# Altium schematic sheet Cross.SchDoc
size A4
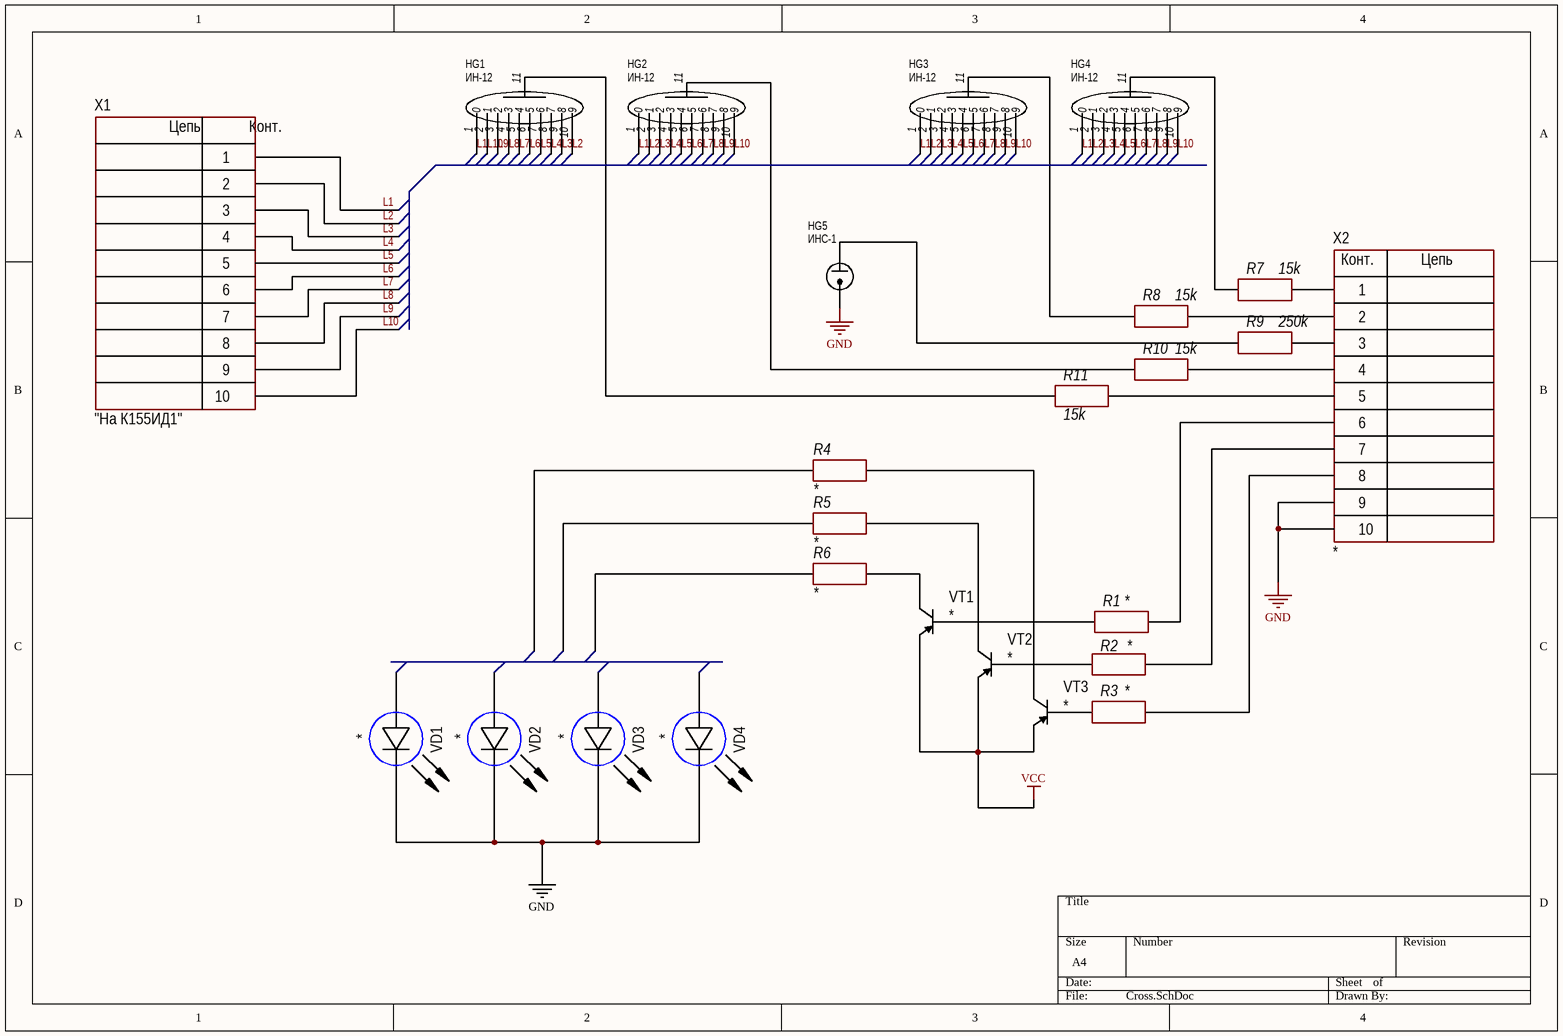
[diagram p0: Cross.SchDoc]

## Parts
HG1  ИН-12  [PCBComponent_1]
HG2  ИН-12  [PCBComponent_1]
HG3  ИН-12  [PCBComponent_1]
HG4  ИН-12  [PCBComponent_1]
HG5  ИНС-1  [ИНС-1]
R1  *  [MLT]
R2  *  [MLT]
R3  *  [MLT]
R4  *  [MLT]
R5  *  [MLT]
R6  *  [MLT]
R7  15k  [MLT]
R8  15k  [MLT]
R9  250k  [MLT]
R10  15k  [MLT]
R11  15k  [MLT]
VD1  *  [CH1206LY]
VD2  *  [CH1206LY]
VD3  *  [CH1206LY]
VD4  *  [CH1206LY]
VT1  *  [TO220_123]
VT2  *  [TO220_123]
VT3  *  [TO220_123]
X1  "На К155ИД1"  [CON: PLS-10]
X2  *  [CON: PLS-10]

## Nets
GND: HG5.1 VD1.2(C) VD2.2(C) VD3.2(C) VD4.2(C) X2.9 X2.10
VCC: VT1.2(E) VT2.2(E) VT3.2(E)
L1: HG1.1(0) HG2.1(0) HG3.1(0) HG4.1(0) X1.1
L2: HG1.10(9) HG2.2(1) HG3.2(1) HG4.2(1) X1.2
L3: HG1.9(8) HG2.3(2) HG3.3(2) HG4.3(2) X1.3
L4: HG1.8(7) HG2.4(3) HG3.4(3) HG4.4(3) X1.4
L5: HG1.7(6) HG2.5(4) HG3.5(4) HG4.5(4) X1.5
L6: HG1.6(5) HG2.6(5) HG3.6(5) HG4.6(5) X1.6
L7: HG1.5(4) HG2.7(6) HG3.7(6) HG4.7(6) X1.7
L8: HG1.4(3) HG2.8(7) HG3.8(7) HG4.8(7) X1.8
L9: HG1.3(2) HG2.9(8) HG3.9(8) HG4.9(8) X1.9
L10: HG1.2(1) HG2.10(9) HG3.10(9) HG4.10(9) X1.10
NetHG1_11: HG1.11 R11.1
NetHG2_11: HG2.11 R10.1
NetHG3_11: HG3.11 R8.1
NetHG4_11: HG4.11 R7.1
NetHG5_2: HG5.2 R9.1
NetR1_1: R1.1 VT1.1(B)
NetR1_2: R1.2 X2.6
NetR2_1: R2.1 VT2.1(B)
NetR2_2: R2.2 X2.7
NetR3_1: R3.1 VT3.1(B)
NetR3_2: R3.2 X2.8
NetR4_2: R4.2 VT3.3(C)
NetR5_2: R5.2 VT2.3(C)
NetR6_2: R6.2 VT1.3(C)
NetR7_2: R7.2 X2.1
NetR8_2: R8.2 X2.2
NetR9_2: R9.2 X2.3
NetR10_2: R10.2 X2.4
NetR11_2: R11.2 X2.5

Not connected (* = marked no-connect by the designer): R4 1; R5 1; R6 1; VD1 1(A); VD2 1(A); VD3 1(A); VD4 1(A)

## Notes on the sheet
- (in symbol 10-Connector) Цепь; Конт.

## Library data of the parts
HG1-HG4 = IN-12: Model: *; Manufacture: *; HelpURL: *; Case: *
R1-R8 R10 R11 = Resistor: MLT; Model: *; Manufacture: *; HelpURL: *; Case: *
  R1-R6: Value: *
  R7 R8 R10 R11: Value: 15k
R9 = Resistor: MLT; Value: 15k; Model: *; Manufacture: *; HelpURL: *; Case: *
VD1-VD4 = LED: Manufacturer: *; Model: *; HelpURL: *; ComponentKind: *; Value: *
VT1-VT3 = PNP: Bipolar; Model: *; Manufacturer: *; ComponentKind: *; HelpURL: *
X1 X2 = 10-Connector: Model: *; Manufacturer: *; HelpURL: *; ComponentKind: *